# Altium schematic sheet SIGNAL.SchDoc
size A4
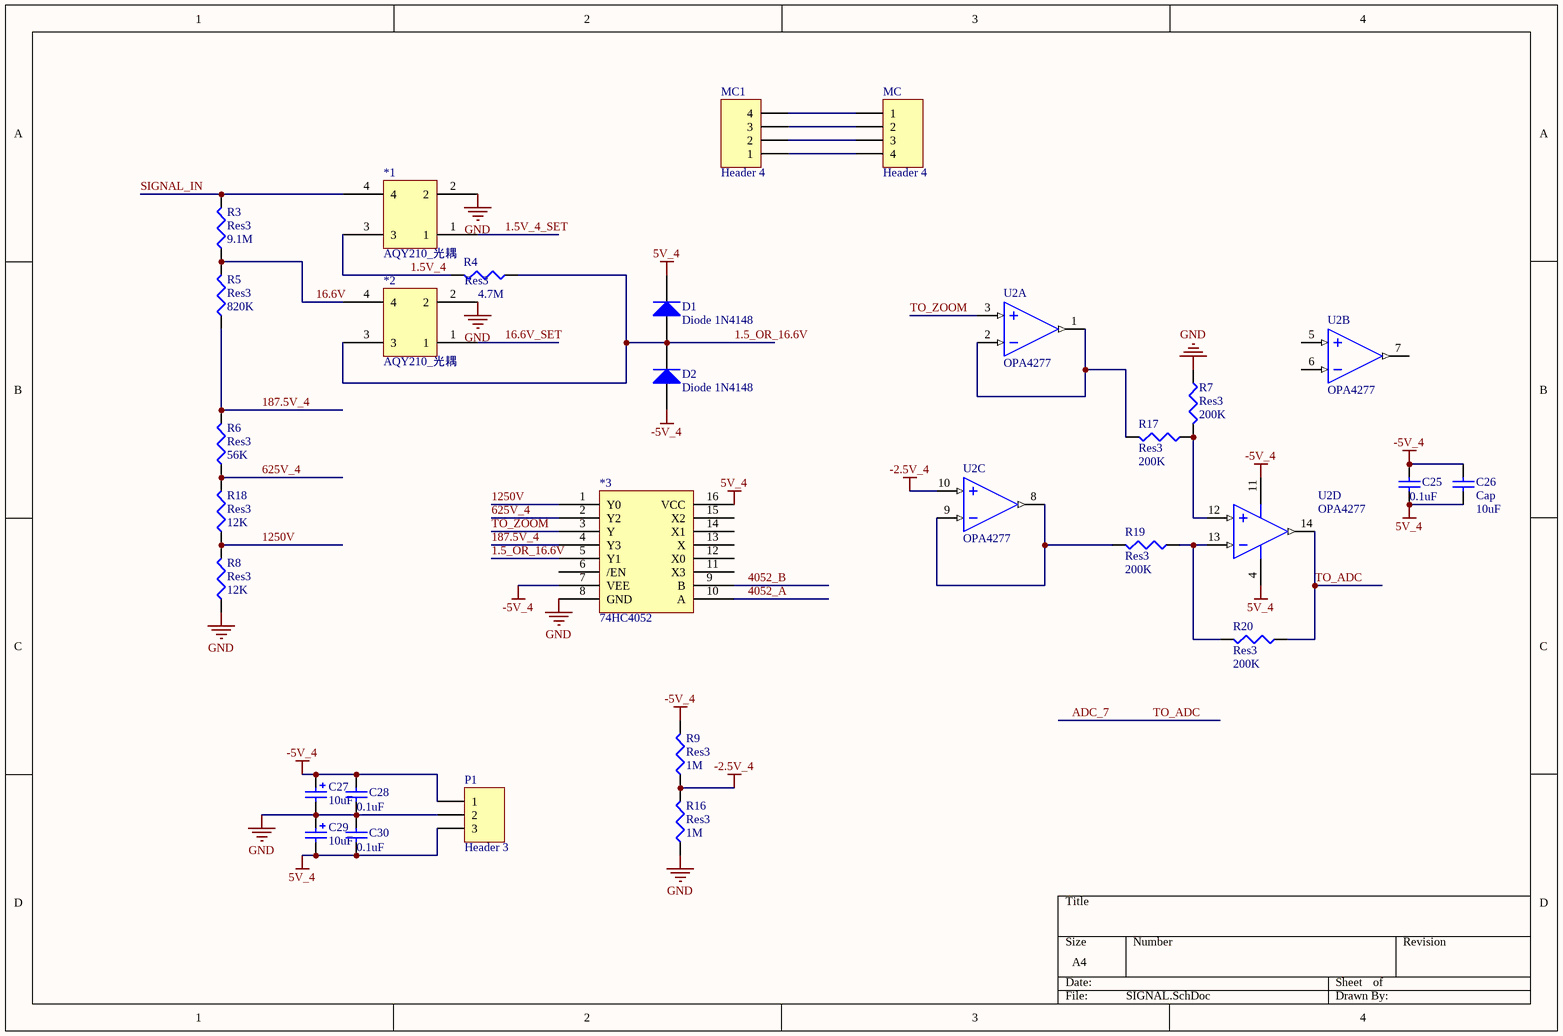
[diagram p0: SIGNAL.SchDoc]

## Parts
*1  AQY210_光耦  [SOT254P605X218-4N]
*2  AQY210_光耦  [SOT254P605X218-4N]
*3  74HC4052  [SOP-16]
C25  value 0.1uF  [c0805]  (hidden comment: Cap)
C26  Cap  value 10uF  [c0805]
C27  value 10uF  [C1206]  (hidden comment: Cap Pol2)
C28  value 0.1uF  [0805]  (hidden comment: Cap)
C29  value 10uF  [C1206]  (hidden comment: Cap Pol2)
C30  value 0.1uF  [0805]  (hidden comment: Cap)
D1  Diode 1N4148  [0805]
D2  Diode 1N4148  [0805]
MC  Header 4  [PCBComponent_1]
MC1  Header 4  [HDR1X4]
P1  Header 3  [HDR1X3]
R3  Res3  value 9.1M  [0805]
R4  Res3  value 4.7M  [0805]
R5  Res3  value 820K  [0805]
R6  Res3  value 56K  [0805]
R7  Res3  value 200K  [0805]
R8  Res3  value 12K  [0805]
R9  Res3  value 1M  [0805]
R16  Res3  value 1M  [0805]
R17  Res3  value 200K  [0805]
R18  Res3  value 12K  [0805]
R19  Res3  value 200K  [0805]
R20  Res3  value 200K  [0805]
U2  OPA4277  [SO-14]  (parts A,B,C,D of 4)

## Nets
5V_4: *3.16(VCC) C25.1 C26.1 C29.2 C30.1 D1.2(K) P1.3 U2.4(V+)
-2.5V_4: R9.1 R16.2 U2.10(IN+)
-5V_4: *3.7(VEE) C25.2 C26.2 C27.1 C28.2 D2.1(A) P1.1 R9.2 U2.11(V-)
GND: *1.2 *2.2 *3.8(GND) C27.2 C28.1 C29.1 C30.2 P1.2 R7.1 R8.1 R16.1
1.5_OR_16.6V: *2.3 *3.5(Y1) D1.1(A) D2.2(K) R4.1
1.5V_4: *1.3 R4.2
1.5V_4_SET: *1.1
16.6V: *2.4 R3.1 R5.2
16.6V_SET: *2.1
187.5V_4: *3.4(Y3) R5.1 R6.2
625V_4: *3.2(Y2) R6.1 R18.2
1250V: *3.1(Y0) R8.2 R18.1
4052_A: *3.10(A)
4052_B: *3.9(B)
ADC_7: R20.1 U2.14(OUT)  [also labelled TO_ADC]
SIGNAL_IN: *1.4 R3.2
TO_ZOOM: *3.3(Y) U2.3(IN+)
NetMC_1: MC.1 MC1.4
NetMC_2: MC.2 MC1.3
NetMC_3: MC.3 MC1.2
NetMC_4: MC.4 MC1.1
NetR7_2: R7.2 R17.1 U2.12(IN+)
NetR17_2: R17.2 U2.1(OUT) U2.2(IN-)
NetR19_1: R19.1 R20.2 U2.13(IN-)
NetR19_2: R19.2 U2.8(OUT) U2.9(IN-)

Not connected (* = marked no-connect by the designer): *3 6(/EN) 11(X3) 12(X0) 13(X) 14(X1) 15(X2); U2 5(IN+) 6(IN-) 7(OUT)

## Library data of the parts
*1 *2 = AQY210_光耦: AQY210
C25 C26 C28 C30 = Cap: Capacitor; Published: 8-Jun-2000; LatestRevisionDate: 17-Jul-2002; LatestRevisionNote: Re-released for DXP Platform.; PackageReference: RAD-0.3; Publisher: Altium Limited
  C26: PackageDescription: Radial Cap, Thru-Hole; 2 Leads; 0.3 in Pin Spacing
C27 C29 = Cap Pol2: Polarized Capacitor (Axial); Published: 8-Jun-2000; LatestRevisionDate: 17-Jul-2002; LatestRevisionNote: Re-released for DXP Platform.; PackageReference: POLAR0.8; Publisher: Altium Limited
D1 D2 = Diode 1N4002: 1 Amp General Purpose Rectifier; Published: 8-Jun-2000; LatestRevisionDate: 17-Jul-2002; LatestRevisionNote: Re-released for DXP Platform.; DatasheetVersion: 1998; PackageVersion: Aug-1999; PackageReference: DO-41; Publisher: Altium Limited; PackageDescription: Diode, Axial; Body 5.2 x 2.7 mm (LxDia. max), Lead Dia. 0.86 mm (max); Code_JEDEC: DO-204-AL; ComponentLink1Description: Manufacturer Link; ComponentLink1URL: http://www.fairchildsemi.com/; ComponentLink2Description: Datasheet; ComponentLink2URL: http://www.fairchildsemi.com/ds/1N%2F1N4001.pdf
MC MC1 = Header 4: Header, 4-Pin; LatestRevisionDate: 17-Jul-2002; LatestRevisionNote: Re-released for DXP Platform.; Publisher: Altium Limited
P1 = Header 3: Header, 3-Pin; LatestRevisionDate: 17-Jul-2002; LatestRevisionNote: Re-released for DXP Platform.; Publisher: Altium Limited
R3-R9 R16-R20 = Res3: Resistor; Published: 8-Jun-2000; LatestRevisionDate: 29-May-2009; LatestRevisionNote: IPC-7351 Footprint Added.; PackageReference: J1-0603; Publisher: Altium Limited; PackageDescription: Chip Resistor
U2 = OPA4277: High Precision Operational Amplifiers; Text Field7: Published 8-Jun-2000